# EAGLE schematic ECU_Adapterplatine (EAGLE 7.7.0)
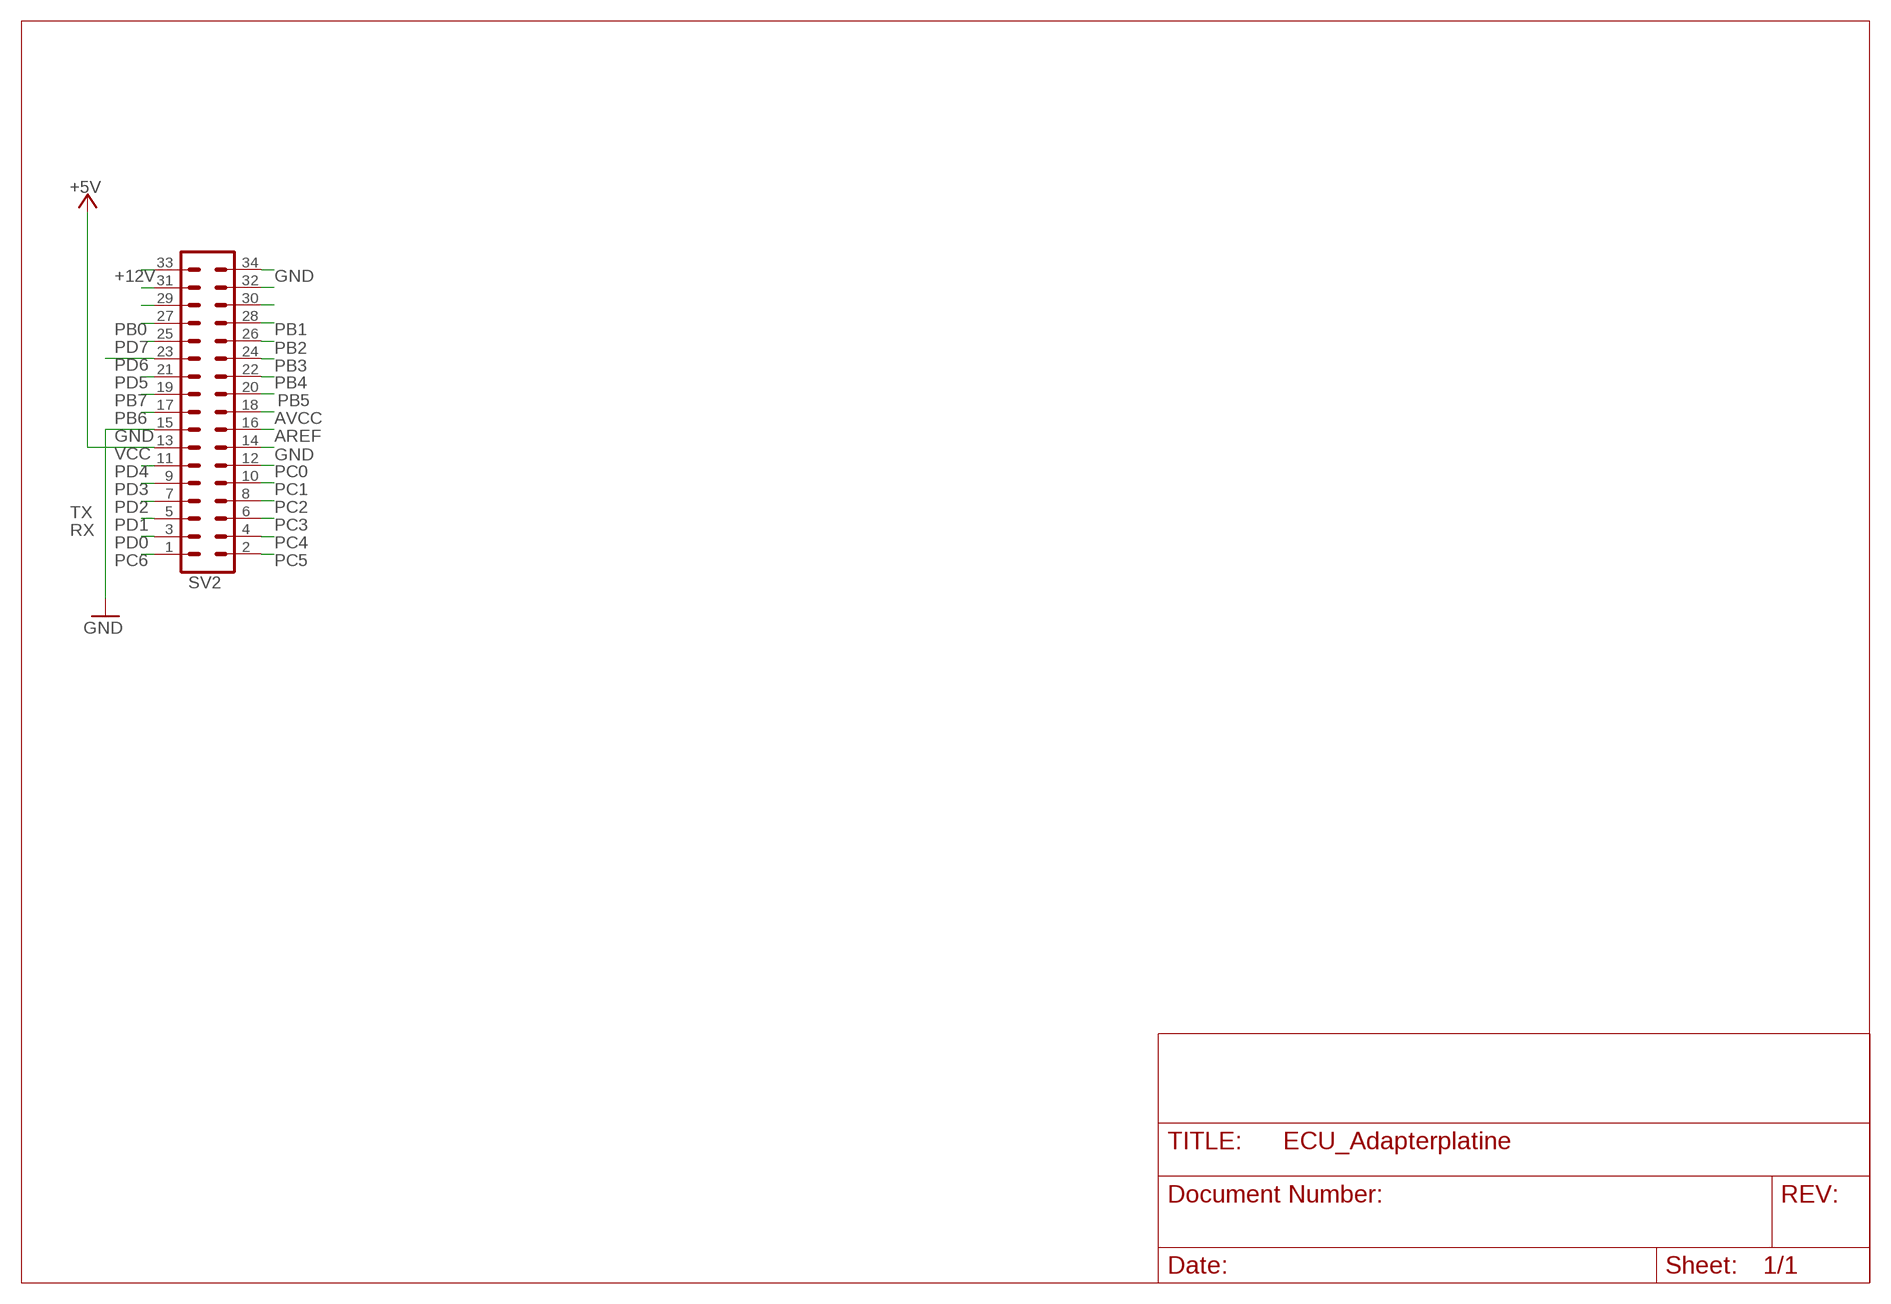
[diagram p0: schematic, sheet 1]

## Parts
SV2  ML34  [ML34]

## Nets
+5V: SV2.13
+12V: SV2.33
AREF: SV2.16
GND: SV2.14 SV2.15 SV2.34
N$12: SV2.18
N$40: SV2.29
N$41: SV2.31
N$44: SV2.32
N$45: SV2.30
PB0: SV2.27
PB1: SV2.28
PB2: SV2.26
PB3: SV2.24
PB4: SV2.22
PB5: SV2.20
PB6: SV2.17
PB7: SV2.19
PC0: SV2.12
PC1: SV2.10
PC2: SV2.8
PC3: SV2.6
PC4: SV2.4
PC5: SV2.2
PC6: SV2.1
PD0: SV2.3
PD1: SV2.5
PD2: SV2.7
PD3: SV2.9
PD4: SV2.11
PD5: SV2.21
PD6: SV2.23
PD7: SV2.25

## Notes on the sheet
- AVCC
- VCC
- TX
- RX

## Library data of the parts
SV2 = con-harting-ml:ML34: HARTING